# EAGLE design 5G8_fpv_tx (EAGLE 7.2.0)
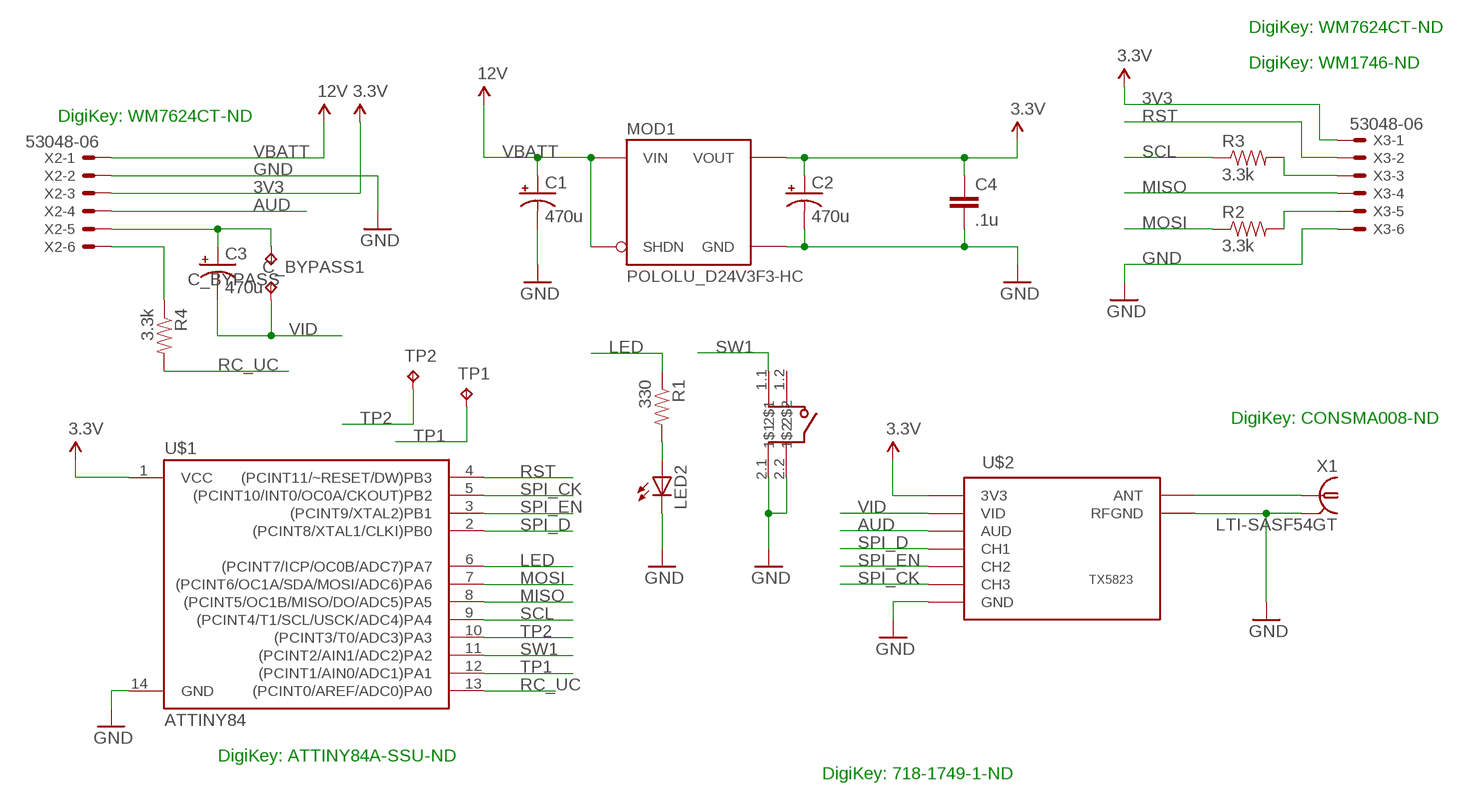
[diagram p0: schematic, sheet 1]

## Parts
C1  470u  VISHAY_D  [VISHAY_D]
C2  470u  VISHAY_D  [VISHAY_D]
C3  470u  VISHAY_D  [VISHAY_D]
C4  .1u  CAP0805  [0805]
C_BYPASS  TPTP06SQ  [TP06SQ]
C_BYPASS1  TPTP06SQ  [TP06SQ]
LED2  LEDCHIPLED_0805  [CHIPLED_0805]
MOD1  POLOLU_D24V3F3-HC  [POLOLU_D24V3F_HC]
R1  330  RESISTOR0805-RES  [0805]
R2  3.3k  RESISTOR0805-RES  [0805]
R3  3.3k  RESISTOR0805-RES  [0805]
R4  3.3k  RESISTOR0805-RES  [0805]
TP1  TPTP20SQ  [TP20SQ]
TP2  TPTP20SQ  [TP20SQ]
U$1  ATTINY84  [SO14]
U$2  TX5823  [TX5823]
U$3  BOURNS_7814G_SW  [7914G]
X1  LTI-SASF54GT  [LTI-SASF54GT]
X2  53048-06  [53048-06]
X3  53048-06  [53048-06]

## Nets
3V3: C2.+ C4.1 MOD1.O(VOUT) U$1.1(VCC) U$2.P$4(3V3) X2.3 X3.1 ; supply symbol labelled 3.3V
ANT: U$2.P$10(ANT) X1.1
AUD: U$2.P$2(AUD) X2.4
GND: C1.- C2.- C4.2 LED2.C MOD1.G(GND) U$1.14(GND) U$2.P$3(GND) U$2.P$5(GND) U$2.P$9(RFGND) U$2.P$11(RFGND) U$3.2.1(2$1) U$3.2.2(2$2) X1.2 X1.3 X1.4 X1.5 X2.2 X3.6
LED: R1.1 U$1.6((PCINT7/ICP/OC0B/ADC7)PA7)
MISO: U$1.8((PCINT5/OC1B/MISO/DO/ADC5)PA5) X3.4
MOSI: R2.1 U$1.7((PCINT6/OC1A/SDA/MOSI/ADC6)PA6)
MOSI_: R2.2 X3.5
N$3: LED2.A R1.2
RC_IN: R4.1 X2.6
RC_UC: R4.2 U$1.13((PCINT0/AREF/ADC0)PA0)
RST: U$1.4((PCINT11/~RESET/DW)PB3) X3.2
SCL: R3.1 U$1.9((PCINT4/T1/SCL/USCK/ADC4)PA4)
SCL_: R3.2 X3.3
SPI_CK: U$1.5((PCINT10/INT0/OC0A/CKOUT)PB2) U$2.P$8(CH3)
SPI_D: U$1.2((PCINT8/XTAL1/CLKI)PB0) U$2.P$6(CH1)
SPI_EN: U$1.3((PCINT9/XTAL2)PB1) U$2.P$7(CH2)
SW1: U$1.11((PCINT2/AIN1/ADC2)PA2) U$3.1.1(1$1)
TP1: TP1.TP U$1.12((PCINT1/AIN0/ADC1)PA1)
TP2: TP2.TP U$1.10((PCINT3/T0/ADC3)PA3)
VBATT: C1.+ MOD1.I(VIN) MOD1.S(SHDN) X2.1 ; supply symbol labelled 12V
VID: C3.- C_BYPASS1.TP U$2.P$1(VID)
VID_IN: C3.+ C_BYPASS.TP X2.5
Unconnected: U$3.1.2(1$2)

## Notes on the sheet
- DigiKey: WM7624CT-ND
- DigiKey: WM1746-ND
- DigiKey: WM7624CT-ND
- DigiKey: CONSMA008-ND
- DigiKey: ATTINY84A-SSU-ND
- DigiKey: 718-1749-1-ND

## Library data of the parts
C1-C3 = 5G8_fpv:VISHAY_D
C4 = SparkFun-Passives:CAP: Capacitor Standard 0603 ceramic capacitor, and 0.1" leaded capacitor.
C_BYPASS C_BYPASS1 TP1 TP2 = testpad:TP: Test pad
LED2 = led:LED: LED OSRAM: - CHIPLED LG R971, LG N971, LY N971, LG Q971, LY Q971, LO R971, LY R971 LH N974, LH R974 LS Q976, LO Q976, LY Q976 LO Q996 - Hyper CHIPLED LW Q18S LB Q993, LB Q99A, LB R99A - SideLED LS A670, LO A670, LY A670, LG A670, LP A670 LB A673, LV A673, LT A673, LW A673 LH A674 LY A675 LS A676, LA A676, LO A676, LY A676, LW A676 LS A679, LY A679, LG A679 - Hyper Micro SIDELED® LS Y876, LA Y876, LO Y876, LY Y876 LT Y87S - SmartLED LW L88C, LW L88S LB L89C, LB L89S, LG L890 LS L89K, LO L89K, LY L89K LS L896, LA L896, LO L896, LY L896 - TOPLED LS T670, LO T670, LY T670, LG T670, LP T670 LSG T670, LSP T670, LSY T670, LOP T670, LYG T670 LG T671, LOG T671, LSG T671 LB T673, LV T673, LT T673, LW T673 LH T674 LS T676, LA T676, LO T676, LY T676, LB T676, LH T676, LSB T676, LW T676 LB T67C, LV T67C, LT T67C, LS T67K, LO T67K, LY T67K, LW E67C LS E67B, LA E67B, LO E67B, LY E67B, LB E67C, LV E67C, LT E67C LW T67C LS T679, LY T679, LG T679 LS T770, LO T770, LY T770, LG T770, LP T770 LB T773, LV T773, LT T773, LW T773 LH T774 LS E675, LA E675, LY E675, LS T675 LS T776, LA T776, LO T776, LY T776, LB T776 LHGB T686 LT T68C, LB T68C - Hyper Mini TOPLED® LB M676 - Mini TOPLED Santana® LG M470 LS M47K, LO M47K, LY M47K Source: http://www.osram.convergy.de LUXEON: - LUMILED® LXK2-PW12-R00, LXK2-PW12-S00, LXK2-PW14-U00, LXK2-PW14-V00 LXK2-PM12-R00, LXK2-PM12-S00, LXK2-PM14-U00 LXK2-PE12-Q00, LXK2-PE12-R00, LXK2-PE12-S00, LXK2-PE14-T00, LXK2-PE14-U00 LXK2-PB12-K00, LXK2-PB12-L00, LXK2-PB12-M00, LXK2-PB14-N00, LXK2-PB14-P00, LXK2-PB14-Q00 LXK2-PR12-L00, LXK2-PR12-M00, LXK2-PR14-Q00, LXK2-PR14-R00 LXK2-PD12-Q00, LXK2-PD12-R00, LXK2-PD12-S00 LXK2-PH12-R00, LXK2-PH12-S00 LXK2-PL12-P00, LXK2-PL12-Q00, LXK2-PL12-R00 Source: www.luxeon.com KINGBRIGHT: KA-3528ASYC Source: www.kingbright.com
MOD1 = Pololu:POLOLU_D24V3F*: Pololu Step Down Voltage Regulators Series D24V3F_ (300 mA) 0.4"x0.5" SOURCE www.pololu.com/ PACKAGE THT; 4-pin (0.1"); 0.4"x0.5" TECHNOLOGIES D24V3F… Vo/V Vi/V (for max. Io) X: (generic) 3: 3.3 3.8 ( 4.3) … 42.0 5: 5.0 6.0 ( 6.5) … 42.0 9: 9.0 10.5 (12.5) … 42.0 12: 12.0 14.0 (17.5) … 42.0 Io: 300 mA; Quiescent Current: 2 mA (SHDN: 20 uA) Author: Dipl.-Ing. FH Rainer Bayer
R1-R4 = SparkFun-Passives:RESISTOR: Resistor Basic schematic elements and footprints for 0603, 1206, and PTH resistors.
U$1 = SparkFun-DigitalIC:ATTINY84: Atmel 14-pin 2/4/8kB flash uC; PROD_ID: IC-11285
U$2 = 5G8_fpv:TX5823
U$3 = 5G8_fpv:BOURNS_7814G_SW
X1 = con-coax:LTI-SASF54GT: SMA vertical PCB thrue hole jack Source: Lighthorse Technologies, inc. SASF54GT.pdf; OC_FARNELL: unknown; OC_NEWARK: unknown
X2 X3 = con-molex:53?-06: CONNECTOR wire to board 1.25 mm (.049 inch) pitch header; MF: WALDOM/MOLEX; MPN: 53048-0610; OC_FARNELL: 1012260; OC_NEWARK: 38C9911

## Board
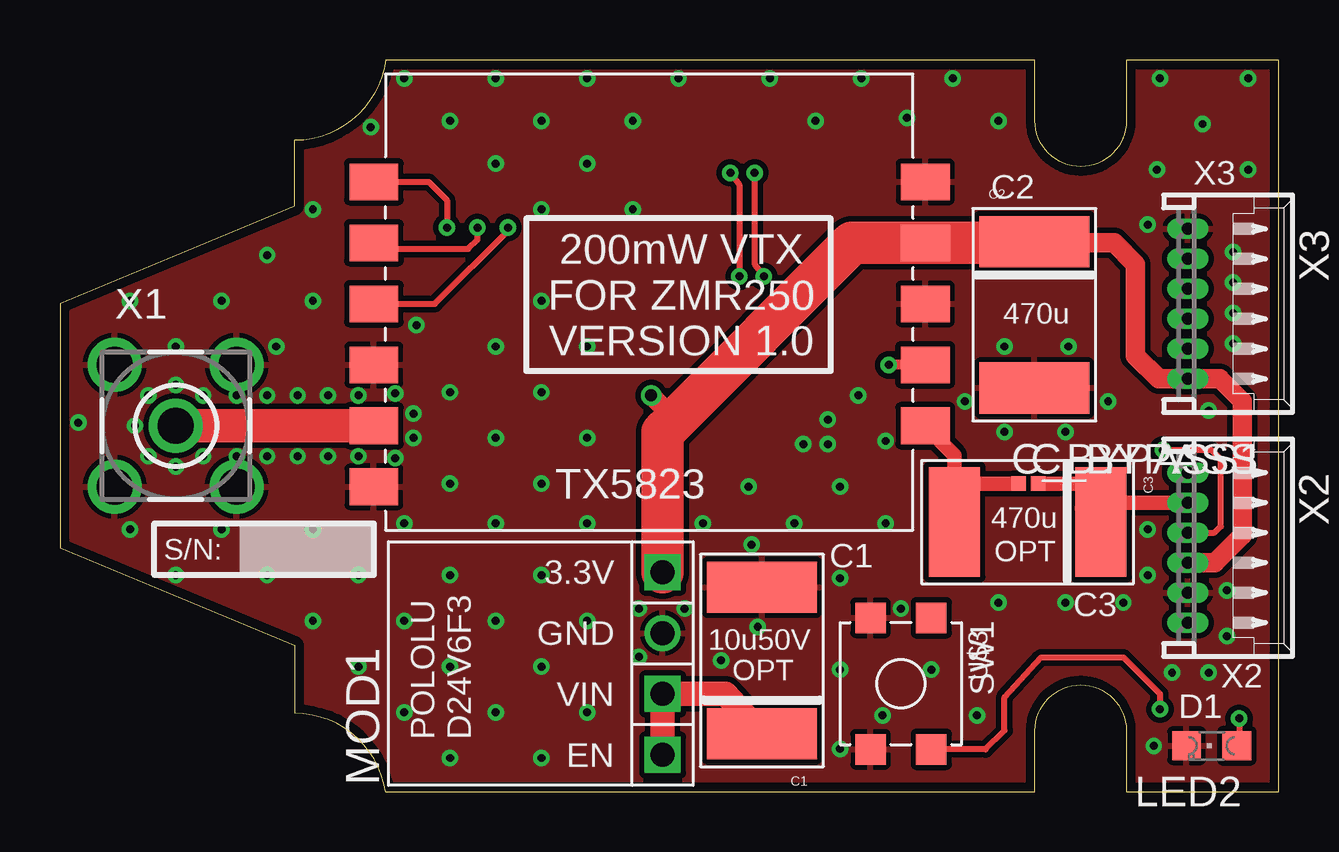
[diagram p1: board, top side]
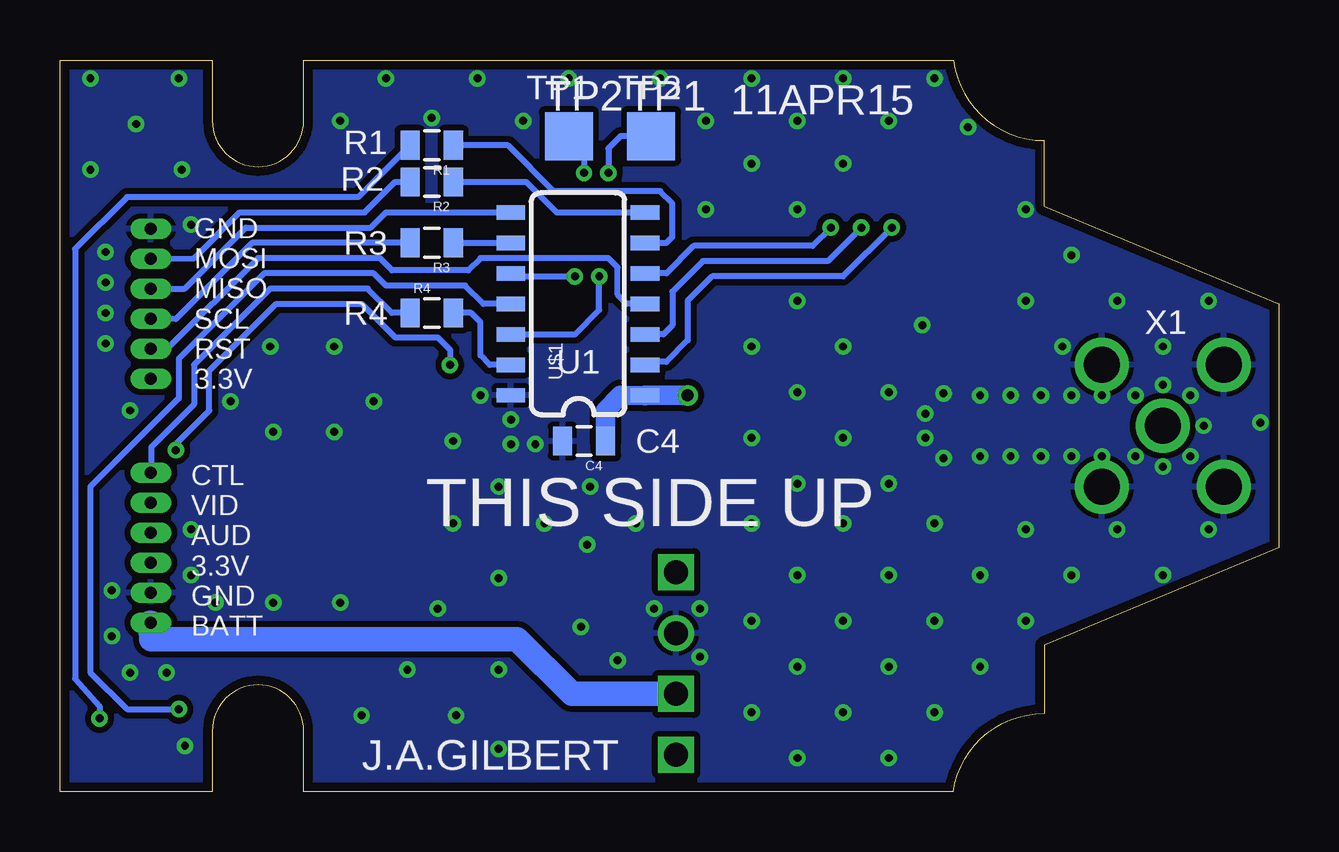
[diagram p2: board, bottom side, seen from below]

Size 50.8 x 30.48 mm. Coordinates in mm from the lower left corner, seen from the top.
Outline: 0,10.16 9.78,6.1 9.78,3.25 arc-82 13.56,0 40.64,0 40.64,2.54 arc-180 44.45,2.54 44.45,0 50.8,0 50.8,30.48 44.45,30.48 44.45,27.94 arc-180 40.64,27.94 40.64,30.48 13.56,30.48 arc-83 9.78,27.13 9.78,24.38 0,20.32 0,10.16
Copper layers (1*16): Top 0.0356mm / dielectric 1.5011mm / Bottom 0.0356mm
Design rules "oshpark-2layer *": minimum track width 6mil, minimum drill 13mil, track to track 6mil, track to pad 6mil, pad to pad 6mil, via to via 6mil, smd to smd 6mil, copper to edge 15mil, drill to drill 6mil, minimum pad ring 7mil, minimum via ring 7mil, stop-mask expansion 4mil, vias tented up to drill 20mil, thermal gap 8mil

### Footprints (pad centres in the part's own frame; a part is rotated, then mirrored left to right if it is on the bottom)
VISHAY_D = smd 4.572 x 2.134: + 0,3.048; - 0,-3.048
0805 = smd 0.8 x 1.2: 1 -0.9,0; 2 0.9,0
TP06SQ = smd 0.6 x 0.6: TP 0,0
CHIPLED_0805 = smd 1.2 x 1.2: A 0,-1.05; C 0,1.05
POLOLU_D24V3F_HC = drill 1: G 1.27,-5.715 | drill 1 square: I -1.27,-5.715; O 3.81,-5.715; S -3.81,-5.715
TP20SQ = smd 2 x 2: TP 0,0
SO14 = smd 0.6 x 1.2: 1 -3.81,-2.8; 2 -2.54,-2.8; 3 -1.27,-2.8; 4 0,-2.8; 5 1.27,-2.8; 6 2.54,-2.8; 7 3.81,-2.8; 8 3.81,2.8; 9 2.54,2.8; 10 1.27,2.8; 11 0,2.8; 12 -1.27,2.8; 13 -2.54,2.8; 14 -3.81,2.8
TX5823 = smd 2.032 x 1.524: P$1 0,0; P$2 0,-2.54; P$3 0,-5.08; P$4 0,-7.62; P$5 0,-10.16; P$6 22.987,-10.16; P$7 22.987,-7.62; P$8 22.987,-5.08; P$9 22.987,-2.54; P$10 22.987,0; P$11 22.987,2.54
7914G = smd 1.27 x 1.27: 1.1 0,5.486; 1.2 0,0; 2.1 2.54,5.486; 2.2 2.54,0
LTI-SASF54GT = drill 1.5 pad 2.2: 1 0,0; 2 -2.54,2.54; 3 2.54,2.54; 4 2.54,-2.54; 5 -2.54,-2.54
53048-06 = drill 0.5 pad 0.698 long: 1 3.125,-1.25; 2 1.875,-1.25; 3 0.625,-1.25; 4 -0.625,-1.25; 5 -1.875,-1.25; 6 -3.125,-1.25

### Placement (x,y rotation side)
C1  29.26,5.46 180 top
C2  40.61,19.86 0 top
C3  40.34,11.23 270 top
C4  28.96,14.6 180 bottom
C_BYPASS  40.77,12.83 0 top
C_BYPASS1  39.95,12.83 0 top
LED2  48.01,1.9 90 top
MOD1  19.41,5.33 90 top
R1  35.31,26.92 180 bottom
R2  35.31,25.4 180 bottom
R3  35.31,22.86 180 bottom
R4  35.31,19.94 0 bottom
TP1  26.16,27.3 0 bottom
TP2  29.59,27.3 0 bottom
U$1  29.21,20.32 90 bottom
U$2  36.07,15.24 180 top
U$3  36.32,7.24 180 top
X1  4.83,15.24 0 top
X2  48.26,10.16 270 top
X3  48.26,20.32 270 top

### Tracks (layer width: path | path; a pad name or v marks a point on that pad's centre or on a via)
3V3  (via drill 0.5)
  Top 0.813: 40.89,22.86 43.94,22.86 44.83,21.97 44.83,18.16 45.8,17.2 X3.1 48.34,17.2 49.28,16.26 49.28,10.67 48.14,9.54 X2.3 | 24.87,11.68 arc90 25.12,12.06 | v24.64,16.51 25.4,15.75 25.4,15.24
  Top 1.778: MOD1.O 25.12,12.06 25.12,14.96 25.4,15.24 33.02,22.86 U$2.P$4 40.89,22.86 C2.+
  Bottom 0.813: C4.1 28.07,15.87 27.43,16.52 26.41,16.49 | 26.41,16.49 U$1.1 | 26.41,16.49 26.39,16.51 v24.64,16.51
ANT
  Top 1.397: U$2.P$10 X1.1
AUD  (via drill 0.33)
  Top 0.254: X2.4 48.12,10.79 48.39,11.05 48.39,13.84 48.01,14.22 v45.97,14.22
  Top 0.406: U$2.P$2 v34.54,17.78
  Bottom 0.254: v45.97,14.22 45.97,14.48 44.58,15.87 44.58,17.53 41.78,20.32 38.23,20.32 36.83,18.92 35.05,18.92 34.54,18.42 v34.54,17.78
GND  (via drill 0.33)
  other vias: 12.45,13.97 11.18,13.97 9.91,13.97 8.64,13.97 5.97,13.97 5.97,16.51 8.64,16.51 9.91,16.51 11.18,16.51 12.45,16.51 6.73,20.45 39.37,18.54 14.73,15.75 7.37,16.51 7.37,13.97 4.83,16.94 3.68,16.51 3.68,13.97 4.83,13.54 3.12,15.24 13.97,16.59 13.97,13.89 42.04,18.54 43.69,16.26 41.91,14.99 37.72,16.26 14.73,14.73 4.83,18.54 10.54,20.45 2.92,20.45 45.34,23.62 48.9,21.21 48.9,22.48 48.9,19.94 48.9,18.67 47.88,15.87 44.32,7.87 48.64,8.38 48.64,6.48 45.34,9.02 47.88,4.95 46.36,4.95 45.34,10.92 45.59,1.9 41.91,7.87 8.64,22.35 9.02,18.54 10.54,24.26 2.92,10.92 6.73,10.92 4.83,9.02 8.64,9.02 10.54,7.11 10.54,10.92 12.45,9.02 12.45,5.21 14.35,3.3 16.26,1.4 20.07,1.4 18.16,3.3 16.26,5.21 14.35,7.11 16.26,9.02 14.35,11.18 18.16,7.11 20.07,5.21 21.97,3.3 21.97,7.11 20.07,9.02 21.97,11.18 18.16,11.18 16.26,12.83 20.07,12.83 21.97,14.73 21.97,18.54 20.07,16.64 18.16,14.73 16.26,16.64 18.16,18.54 20.07,20.45 14.86,19.43 23.88,24.26 20.07,24.26 18.16,26.16 16.26,27.94 20.07,27.94 21.97,26.16 23.88,27.94 31.5,27.94 35.31,28.07 39.12,27.94 37.21,29.72 33.4,29.72 29.59,29.72 25.78,29.72 21.97,29.72 18.16,29.72 14.35,29.72 12.95,27.69 0.76,15.37 39.12,7.87 36.32,5.08 34.29,3.18 32.51,5.08 38.23,3.18 35.05,7.62 32.51,8.89 34.42,11.18 32.51,12.7 30.61,11.18 26.8,11.18 28.7,12.7 34.42,14.6 30.99,14.48 33.27,16.51 32,15.49 39.37,14.99 32.51,1.78 27.56,5.46 29.08,6.86 45.85,29.72 49.53,29.72 47.62,27.81 49.53,25.91 45.72,25.91 32,14.48 28.83,10.29 24.13,5.61 24.13,7.62 26.04,7.62
  pour Top (isolate 0.229): 0,30.48 0,0 50.8,0 50.8,30.48
  pour Bottom (isolate 0.254): 0,30.48 0,0 50.8,0 50.8,30.48
LED
  Bottom 0.254: U$1.6 25.53,22.86 25.27,23.11 25.27,24.51 25.78,25.02 30.23,25.02 32.13,26.92 R1.1
MISO
  Bottom 0.254: 46.37,20.95 45.59,20.96 43.05,23.5 37.85,23.5 37.21,24.13 U$1.8
  Bottom 0.406: X3.4 46.37,20.95
MOSI
  Bottom 0.254: R2.1 31.37,25.4 30.1,24.13 U$1.7
MOSI_
  Bottom 0.254: 46.38,22.2 45.21,22.23 43.31,24.13 38.1,24.13 36.83,25.4 R2.2
  Bottom 0.406: X3.5 46.38,22.2
N$3  (via drill 0.33)
  Top 0.254: v49.15,3.05 49.15,2 LED2.A
  Bottom 0.254: R1.2 38.37,24.77 48.01,24.77 50.16,22.61 50.16,4.7 49.15,3.56 v49.15,3.05
RC_IN
  Bottom 0.254: R4.1 36.96,19.94 37.97,20.96 42.04,20.96 45.21,17.78 45.21,16.13 46.99,14.35 46.99,13.3
  Bottom 0.406: 46.99,13.3 X2.6
RC_UC
  Bottom 0.254: U$1.13 32.89,17.78 33.27,18.17 33.27,19.56 33.66,19.94 R4.2
RST
  Bottom 0.254: U$1.4 27.18,20.32 27.56,20.7 27.56,21.84 27.94,22.23 33.27,22.23 33.78,21.72 36.96,21.72 37.47,22.23 42.55,22.23 46.33,18.45 X3.2
SCL
  Bottom 0.254: R3.1 U$1.9
SCL_
  Bottom 0.254: R3.2 42.8,22.86 45.97,19.69 46.34,19.7
  Bottom 0.406: 46.34,19.7 X3.3
SPI_CK  (via drill 0.33)
  Top 0.254: U$2.P$8 15.62,20.32 18.67,23.37 v18.67,23.5
  Bottom 0.254: v18.67,23.5 19.43,22.73 24.38,22.73 25.53,21.59 U$1.5
SPI_D  (via drill 0.33)
  Top 0.254: U$2.P$6 15.37,25.4 16.13,24.64 v16.13,23.5
  Top 0.406: 16.13,23.62 v16.13,23.5
  Bottom 0.254: v16.13,23.5 18.16,21.46 23.62,21.46 24.64,20.45 24.64,18.8 25.53,17.91 26.28,17.91 U$1.2
SPI_EN  (via drill 0.33)
  Top 0.254: U$2.P$7 13.84,22.61 17.02,22.61 17.4,22.99 v17.4,23.5
  Bottom 0.254: v17.4,23.5 18.8,22.1 24,22.1 25.27,20.83 25.27,19.43 25.65,19.05 U$1.3
SW1  (via drill 0.33)
  Top 0.254: v45.85,3.43 45.85,4.06 44.32,5.59 40.89,5.59 39.37,3.94 39.37,2.54 38.58,1.75 U$3.1.1
  Bottom 0.254: U$1.11 33.15,20.32 33.91,21.08 37.21,21.08 37.72,21.59 42.29,21.59 45.85,18.03 45.85,16.38 49.53,12.7 49.53,4.95 48.01,3.43 v45.85,3.43
TP1  (via drill 0.33)
  Top 0.254: v27.94,25.78 28.32,25.27 v28.32,21.46
  Bottom 0.254: U$1.12 29.34,19.05 28.32,20.07 v28.32,21.46 | TP1.TP 27.43,27.3 27.94,26.8 v27.94,25.78
TP2  (via drill 0.33)
  Top 0.254: v28.96,25.78 28.96,21.97 v29.34,21.46
  Bottom 0.254: U$1.10 31.88,21.46 v29.34,21.46 | TP2.TP 28.96,26.54 v28.96,25.78
VBATT
  Top 1.016: C1.+ 27.74,4.06 MOD1.I MOD1.S
  Bottom 1.016: X2.1 47.04,7.04 46.99,6.35 31.75,6.35 29.46,4.06 MOD1.I
VID
  Top 0.61: C3.- 37.29,11.94 | 37.29,11.94 37.29,14.02 U$2.P$1 | C_BYPASS1.TP 38.18,12.83 37.29,11.94
VID_IN
  Top 0.406: 43.38,12.8 C3.+ 43.38,12.01 43.41,12.04
  Top 0.61: C_BYPASS.TP 43.36,12.83 | X2.5 43.41,12.04
  Top 1.016: 42.8,11.81 arc-90 C3.+ | 43.36,12.83 43.38,12.8

### Text on the board
tPlace: X3 | C2 | 200mW VTX / FOR ZMR250 / VERSION 1.0 | 470u | 470u | S/N: | C1 | OPT | C3 | 10u50V | 3.3V / GND / VIN / EN | OPT | SW1 | X2 | D1 | POLOLU / D24V6F3
bPlace: TP2 | TP1 | 11APR15 | R1 | R2 | R3 | X1 | R4 | U1 | GND / MOSI / MISO / SCL / RST / 3.3V | C4 | THIS SIDE UP | CTL / VID / AUD / 3.3V / GND / BATT | J.A.GILBERT